# Altium project 003.ccd424.PrjPcb
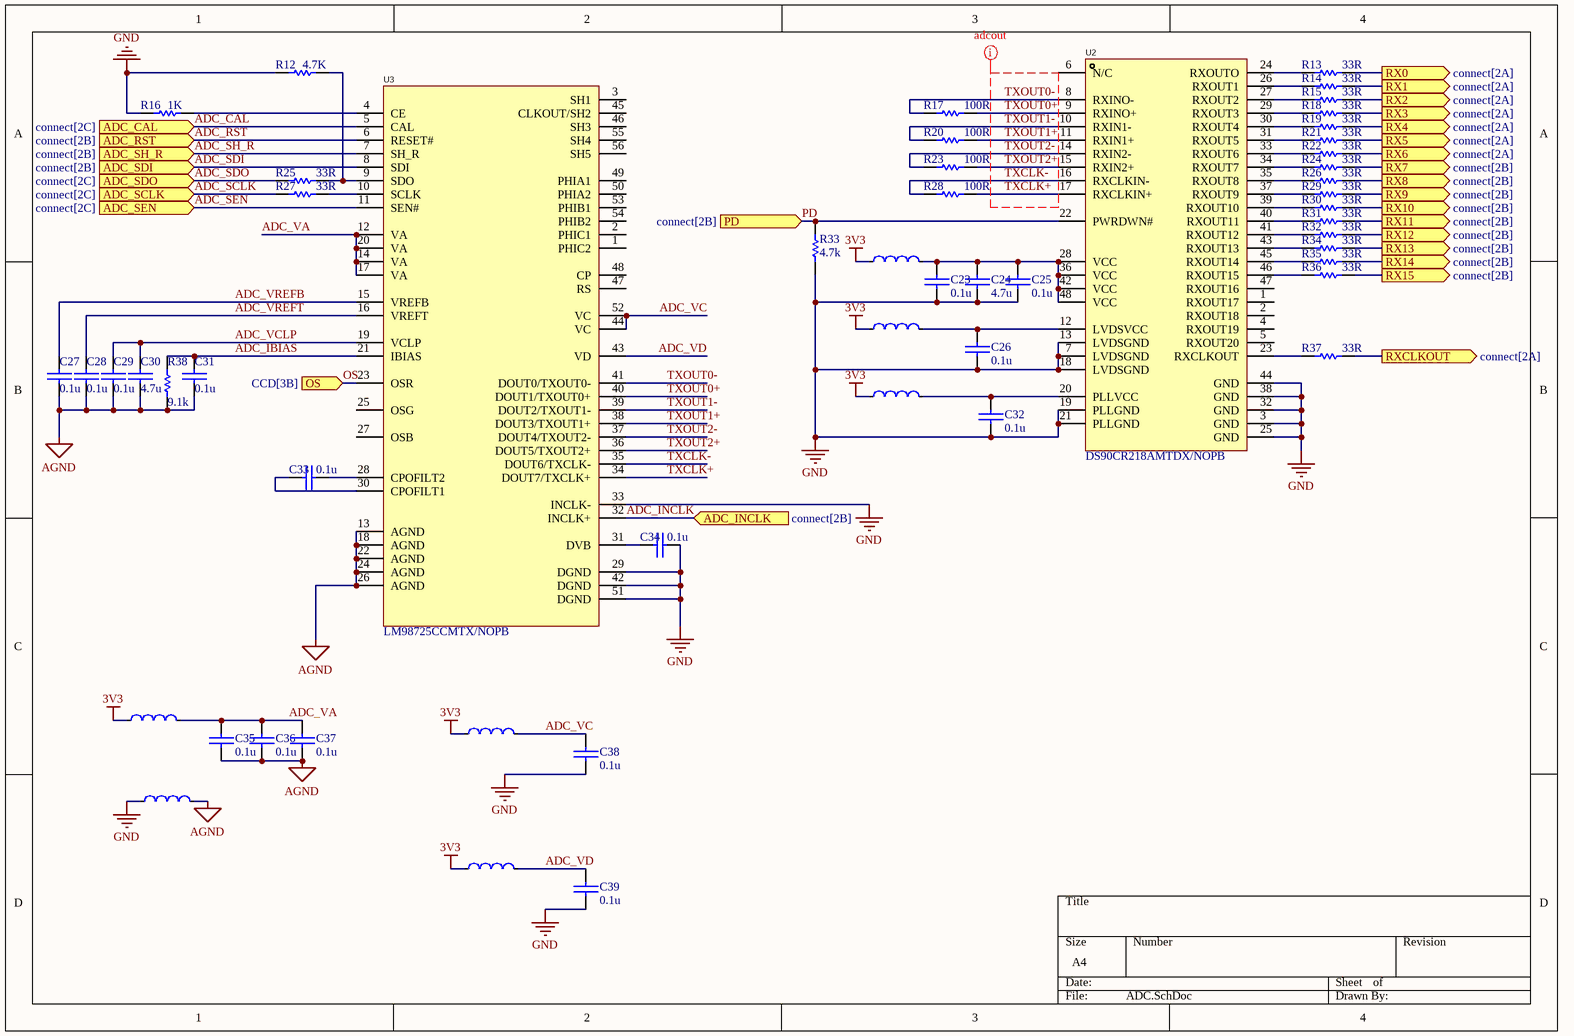
[diagram p0: ADC.SchDoc]
2 sheets, 82 parts. Net scope: flat (ports and power ports of the same name join across sheets).
Board file: PCB2.PcbDoc
Sheets:
  ADC.SchDoc
  timing.SchDoc

## Sheet ADC.SchDoc
size A4; SheetNumber: 3; SheetTotal: 5

### Parts
C23  0.1u  [0603C]
C24  4.7u  [0603C]
C25  0.1u  [0603C]
C26  0.1u  [0603C]
C27  0.1u  [0603C]
C28  0.1u  [0603C]
C29  0.1u  [0603C]
C30  4.7u  [0603C]
C31  0.1u  [0603C]
C32  0.1u  [0603C]
C33  0.1u  [0603C]
C34  0.1u  [0603C]
C35  0.1u  [0603C]
C36  0.1u  [0603C]
C37  0.1u  [0603C]
C38  0.1u  [0603C]
C39  0.1u  [0603C]
L4  GZ1608D601TF  [0603L]  (value not drawn)
L5  GZ1608D601TF  [0603L]  (value not drawn)
L6  GZ1608D601TF  [0603L]  (value not drawn)
L7  GZ1608D601TF  [0603L]  (value not drawn)
L8  GZ1608D601TF  [0603L]  (value not drawn)
L9  GZ1608D601TF  [0603L]  (value not drawn)
L10  GZ1608D601TF  [0603L]  (value not drawn)
R12  4.7K  [0603R]
R13  33R  [0603R]
R14  33R  [0603R]
R15  33R  [0603R]
R16  1K  [0603R]
R17  100R  [0603R]
R18  33R  [0603R]
R19  33R  [0603R]
R20  100R  [0603R]
R21  33R  [0603R]
R22  33R  [0603R]
R23  100R  [0603R]
R24  33R  [0603R]
R25  33R  [0603R]
R26  33R  [0603R]
R27  33R  [0603R]
R28  100R  [0603R]
R29  33R  [0603R]
R30  33R  [0603R]
R31  33R  [0603R]
R32  33R  [0603R]
R33  4.7k  [0603R]
R34  33R  [0603R]
R35  33R  [0603R]
R36  33R  [0603R]
R37  33R  [0603R]
R38  9.1k  [0603R]
U2  DS90CR218AMTDX/NOPB  [TSSOP-48]
U3  LM98725CCMTX/NOPB  [TSSOP-56]

### Ports
ADC_CAL (in, see connect[2C]), ADC_INCLK (in, see connect[2B]), ADC_RST (in, see connect[2B]), ADC_SCLK (in, see connect[2C]), ADC_SDI (in, see connect[2B]), ADC_SDO (in, see connect[2C]), ADC_SEN (in, see connect[2C]), ADC_SH_R (in, see connect[2B]), OS (in, see CCD[3B]), PD (in, see connect[2B]), RX0 (out, see connect[2A]), RX1 (out, see connect[2A]), RX2 (out, see connect[2A]), RX3 (out, see connect[2A]), RX4 (out, see connect[2A]), RX5 (out, see connect[2A]), RX6 (out, see connect[2A]), RX7 (out, see connect[2B]), RX8 (out, see connect[2B]), RX9 (out, see connect[2B]), RX10 (out, see connect[2B]), RX11 (out, see connect[2B]), RX12 (out, see connect[2B]), RX13 (out, see connect[2B]), RX14 (out, see connect[2B]), RX15 (out, see connect[2B]), RXCLKOUT (out, see connect[2A])

### Nets
3V3: L4.1 L5.1 L6.1 L7.1 L8.1 L10.1
AGND: C27.2 C28.2 C29.2 C30.2 C31.2 C35.1 C36.1 C37.1 L9.2 R38.1 U3.13(AGND) U3.18(AGND) U3.22(AGND) U3.24(AGND) U3.26(AGND)
GND: C23.1 C24.1 C25.1 C26.1 C32.1 C34.2 C38.1 C39.1 L9.1 R12.1 R16.1 R33.1 U2.3(GND) U2.7(LVDSGND) U2.13(LVDSGND) U2.18(LVDSGND) U2.19(PLLGND) U2.21(PLLGND) U2.25(GND) U2.32(GND) U2.38(GND) U2.44(GND) U3.29(DGND) U3.33(INCLK-) U3.42(DGND) U3.51(DGND)
ADC_CAL: U3.5(CAL) ; port ADC_CAL
ADC_IBIAS: C31.1 R38.2 U3.21(IBIAS)
ADC_INCLK: U3.32(INCLK+) ; port ADC_INCLK
ADC_RST: U3.6(RESET#) ; port ADC_RST
ADC_SCLK: R27.1 ; port ADC_SCLK
ADC_SDI: U3.8(SDI) ; port ADC_SDI
ADC_SDO: R25.1 ; port ADC_SDO
ADC_SEN: U3.11(SEN#) ; port ADC_SEN
ADC_SH_R: U3.7(SH_R) ; port ADC_SH_R
ADC_VA: C35.2 C36.2 C37.2 L7.2 U3.12(VA) U3.14(VA) U3.17(VA) U3.20(VA)
ADC_VC: C38.2 L8.2 U3.44(VC) U3.52(VC)
ADC_VCLP: C29.1 C30.1 U3.19(VCLP)
ADC_VD: C39.2 L10.2 U3.43(VD)
ADC_VREFB: C27.1 U3.15(VREFB)
ADC_VREFT: C28.1 U3.16(VREFT)
OS: U3.23(OSR) ; port OS
PD: R33.2 U2.22(PWRDWN#) ; port PD
TXCLK+: R28.2 U2.17(RXCLKIN+) U3.34(DOUT7/TXCLK+)
TXCLK-: R28.1 U2.16(RXCLKIN-) U3.35(DOUT6/TXCLK-)
TXOUT0+: R17.2 U2.9(RXINO+) U3.40(DOUT1/TXOUT0+)
TXOUT0-: R17.1 U2.8(RXINO-) U3.41(DOUT0/TXOUT0-)
TXOUT1+: R20.2 U2.11(RXIN1+) U3.38(DOUT3/TXOUT1+)
TXOUT1-: R20.1 U2.10(RXIN1-) U3.39(DOUT2/TXOUT1-)
TXOUT2+: R23.2 U2.15(RXIN2+) U3.36(DOUT5/TXOUT2+)
TXOUT2-: R23.1 U2.14(RXIN2-) U3.37(DOUT4/TXOUT2-)
NetC23_2: C23.2 C24.2 C25.2 L4.2 U2.28(VCC) U2.36(VCC) U2.42(VCC) U2.48(VCC)
NetC26_2: C26.2 L5.2 U2.12(LVDSVCC)
NetC32_2: C32.2 L6.2 U2.20(PLLVCC)
NetC33_1: C33.1 U3.30(CPOFILT1)
NetC33_2: C33.2 U3.28(CPOFILT2)
NetC34_1: C34.1 U3.31(DVB)
NetR12_2: R12.2 R25.2 U3.9(SDO)
NetR13_1: R13.1 U2.24(RXOUTO)
NetR13_2: R13.2 ; port RX0
NetR14_1: R14.1 U2.26(RXOUT1)
NetR14_2: R14.2 ; port RX1
NetR15_1: R15.1 U2.27(RXOUT2)
NetR15_2: R15.2 ; port RX2
NetR16_2: R16.2 U3.4(CE)
NetR18_1: R18.1 U2.29(RXOUT3)
NetR18_2: R18.2 ; port RX3
NetR19_1: R19.1 U2.30(RXOUT4)
NetR19_2: R19.2 ; port RX4
NetR21_1: R21.1 U2.31(RXOUT5)
NetR21_2: R21.2 ; port RX5
NetR22_1: R22.1 U2.33(RXOUT6)
NetR22_2: R22.2 ; port RX6
NetR24_1: R24.1 U2.34(RXOUT7)
NetR24_2: R24.2 ; port RX7
NetR26_1: R26.1 U2.35(RXOUT8)
NetR26_2: R26.2 ; port RX8
NetR27_2: R27.2 U3.10(SCLK)
NetR29_1: R29.1 U2.37(RXOUT9)
NetR29_2: R29.2 ; port RX9
NetR30_1: R30.1 U2.39(RXOUT10)
NetR30_2: R30.2 ; port RX10
NetR31_1: R31.1 U2.40(RXOUT11)
NetR31_2: R31.2 ; port RX11
NetR32_1: R32.1 U2.41(RXOUT12)
NetR32_2: R32.2 ; port RX12
NetR34_1: R34.1 U2.43(RXOUT13)
NetR34_2: R34.2 ; port RX13
NetR35_1: R35.1 U2.45(RXOUT14)
NetR35_2: R35.2 ; port RX14
NetR36_1: R36.1 U2.46(RXOUT15)
NetR36_2: R36.2 ; port RX15
NetR37_1: R37.1 U2.23(RXCLKOUT)
NetR37_2: R37.2 ; port RXCLKOUT

Not connected (* = marked no-connect by the designer): U2 1(RXOUT17) 2(RXOUT18) 4(RXOUT19) 5(RXOUT20) 6(N/C) 47(RXOUT16); U3 1(PHIC2) 2(PHIC1) 3(SH1) 25(OSG) 27(OSB) 45(CLKOUT/SH2) 46(SH3) 47(RS) 48(CP) 49(PHIA1) 50(PHIA2) 53(PHIB1) 54(PHIB2) 55(SH4) 56(SH5)

### Layout directives
mark named adcout: TXCLK+, TXCLK-, TXOUT0+, TXOUT0-, TXOUT1+, TXOUT1-, TXOUT2+, TXOUT2-

### Library data of the parts
C23-C39 = CAP: 无极性电容
L4-L10 = FB: 铁氧体磁珠; Manufacturer: Sunlord(顺络); Add into BOM: yes; Impedance @ Frequency: 600Ω@100MHz; Tolerance: ±25%; DC Resistance: 450mΩ; Current Rating: 200mA; Circuits: 1; Name: GZ1608D601TF; Symbol: GZ1608D601TF; Device: GZ1608D601TF; LCSC Part Name: 600Ω@100MHz ±25%; Supplier Part: C1002; Manufacturer Part: GZ1608D601TF; Supplier Footprint: 0603; JLCPCB Part Class: Basic Part; Datasheet: https://atta.szlcsc.com/upload/public/pdf/source/20210830/355EA7C0FAC5394FC0FE3F17C770C20A.pdf; Supplier: LCSC; Convert to PCB: yes
R12-R38 = RES: 电阻
U2 = DS90CR218AMTDX/NOPB: 解串芯片; Manufacturer: TI(德州仪器); Add into BOM: yes; Name: DS90CR218AMTDX/NOPB; Symbol: DS90CR218AMTDX/NOPB; Device: DS90CR218AMTDX/NOPB; LCSC Part Name: DS90CR218AMTDX/NOPB; Supplier Part: C2674207; Manufacturer Part: DS90CR218AMTDX/NOPB; Supplier Footprint: TSSOP-48; JLCPCB Part Class: Extended Part; Supplier: LCSC; Convert to PCB: yes
U3 = LM98725CCMTX/NOPB: CCD专用ADC; Manufacturer: TI(德州仪器); Add into BOM: yes; Name: LM98725CCMTX/NOPB; Symbol: LM98725CCMTX/NOPB; Device: LM98725CCMTX/NOPB; LCSC Part Name: LM98725CCMTX/NOPB; Supplier Part: C2679405; Manufacturer Part: LM98725CCMTX/NOPB; Supplier Footprint: TSSOP-56; JLCPCB Part Class: Extended Part; Supplier: LCSC; Convert to PCB: yes

## Sheet timing.SchDoc
size A4; SheetNumber: 5; SheetTotal: 5
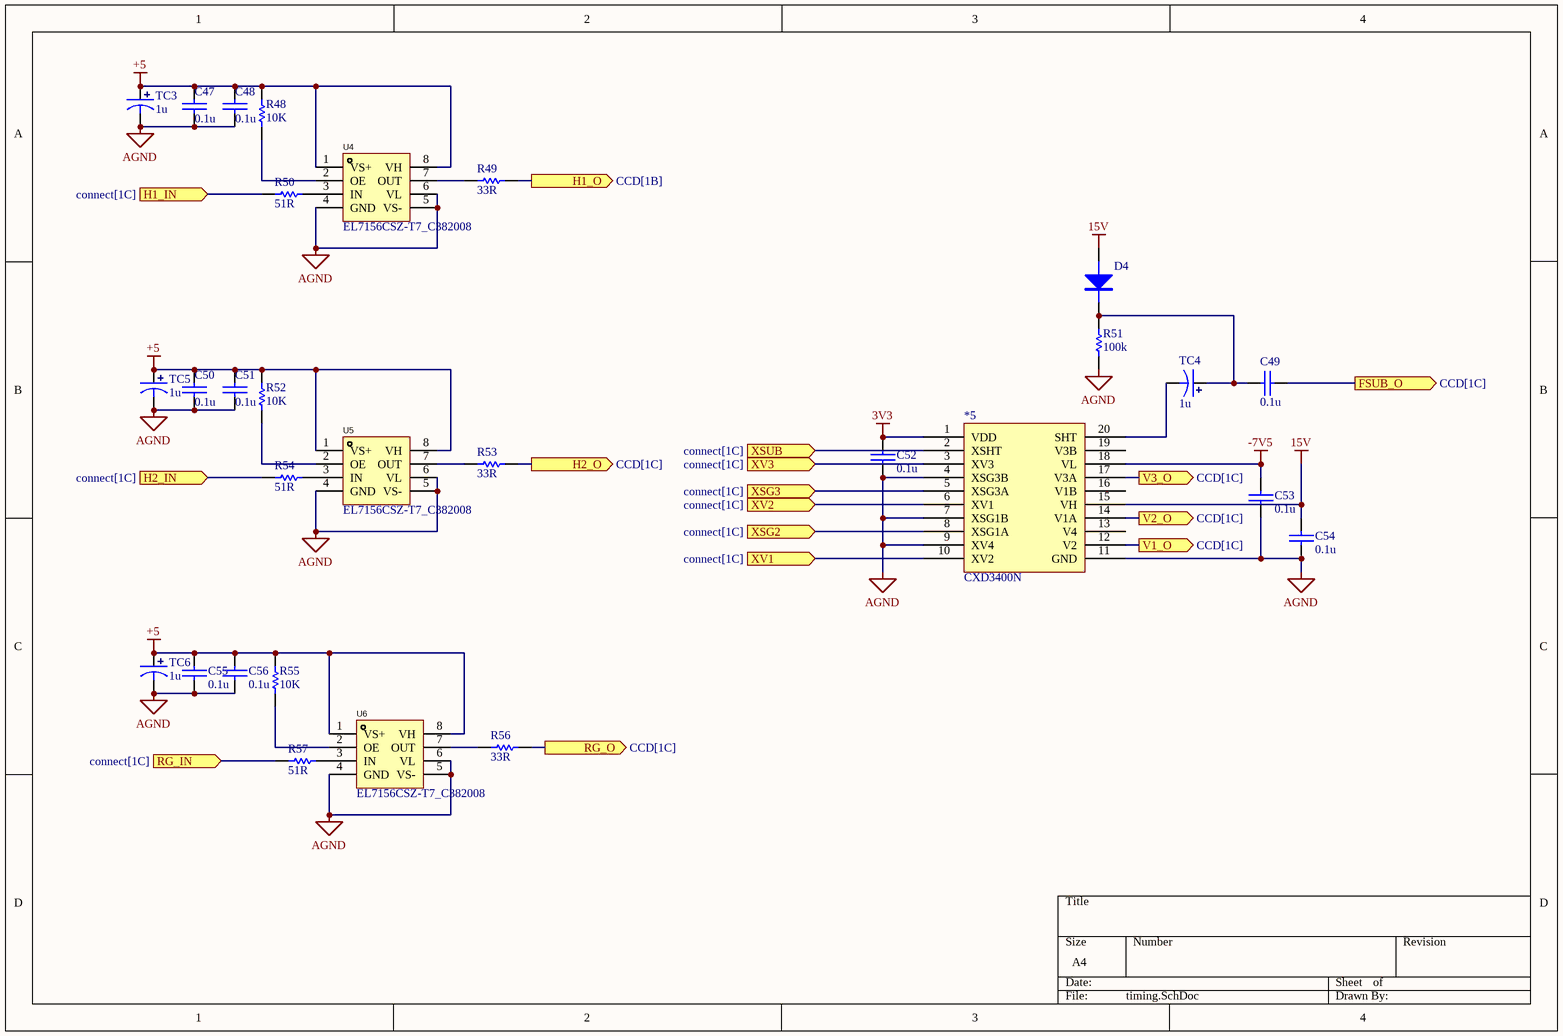
[diagram p1: timing.SchDoc]

### Parts
*5  CXD3400N  [CXD3400N]
C47  0.1u  [0603C]
C48  0.1u  [0603C]
C49  0.1u  [0603C]
C50  0.1u  [0603C]
C51  0.1u  [0603C]
C52  0.1u  [0603C]
C53  0.1u  [0603C]
C54  0.1u  [0603C]
C55  0.1u  [0603C]
C56  0.1u  [0603C]
D4  DIODE  [SOD-123]  (value not drawn)
R48  10K  [0603R]
R49  33R  [0603R]
R50  51R  [0603R]
R51  100k  [0603R]
R52  10K  [0603R]
R53  33R  [0603R]
R54  51R  [0603R]
R55  10K  [0603R]
R56  33R  [0603R]
R57  51R  [0603R]
TC3  1u  [TAJ-A/3216]
TC4  1u  [TAJ-A/3216]
TC5  1u  [TAJ-A/3216]
TC6  1u  [TAJ-A/3216]
U4  EL7156CSZ-T7_C382008  [SOIC-8]
U5  EL7156CSZ-T7_C382008  [SOIC-8]
U6  EL7156CSZ-T7_C382008  [SOIC-8]

### Ports
FSUB_O (out, see CCD[1C]), H1_IN (in, see connect[1C]), H1_O (out, see CCD[1B]), H2_IN (in, see connect[1C]), H2_O (out, see CCD[1C]), RG_IN (in, see connect[1C]), RG_O (out, see CCD[1C]), V1_O (out, see CCD[1C]), V2_O (out, see CCD[1C]), V3_O (out, see CCD[1C]), XSG2 (in, see connect[1C]), XSG3 (in, see connect[1C]), XSUB (in, see connect[1C]), XV1 (in, see connect[1C]), XV2 (in, see connect[1C]), XV3 (in, see connect[1C])

### Nets
3V3: *5.1(VDD) C52.2
15V: *5.15(VH) C54.2 D4.A
+5: C47.1 C48.1 C50.1 C51.1 C55.1 C56.1 R48.1 R52.1 R55.1 TC3.1 TC5.1 TC6.1 U4.1(VS+) U4.8(VH) U5.1(VS+) U5.8(VH) U6.1(VS+) U6.8(VH)
-7V5: *5.18(VL) C53.2
AGND: *5.4(XSG3B) *5.7(XSG1B) *5.9(XV4) *5.11(GND) C47.2 C48.2 C50.2 C51.2 C52.1 C53.1 C54.1 C55.2 C56.2 R51.1 TC3.2 TC5.2 TC6.2 U4.4(GND) U4.5(VS-) U4.6(VL) U5.4(GND) U5.5(VS-) U5.6(VL) U6.4(GND) U6.5(VS-) U6.6(VL)
Net*5_2: *5.2(XSHT) ; port XSUB
Net*5_3: *5.3(XV3) ; port XV3
Net*5_5: *5.5(XSG3A) ; port XSG3
Net*5_6: *5.6(XV1) ; port XV2
Net*5_8: *5.8(XSG1A) ; port XSG2
Net*5_10: *5.10(XV2) ; port XV1
Net*5_12: *5.12(V2) ; port V1_O
Net*5_14: *5.14(V1A) ; port V2_O
Net*5_17: *5.17(V3A) ; port V3_O
Net*5_20: *5.20(SHT) TC4.2
NetC49_1: C49.1 ; port FSUB_O
NetC49_2: C49.2 D4.K R51.2 TC4.1
NetR48_2: R48.2 U4.2(OE)
NetR49_1: R49.1 ; port H1_O
NetR49_2: R49.2 U4.7(OUT)
NetR50_1: R50.1 U4.3(IN)
NetR50_2: R50.2 ; port H1_IN
NetR52_2: R52.2 U5.2(OE)
NetR53_1: R53.1 ; port H2_O
NetR53_2: R53.2 U5.7(OUT)
NetR54_1: R54.1 U5.3(IN)
NetR54_2: R54.2 ; port H2_IN
NetR55_2: R55.2 U6.2(OE)
NetR56_1: R56.1 ; port RG_O
NetR56_2: R56.2 U6.7(OUT)
NetR57_1: R57.1 U6.3(IN)
NetR57_2: R57.2 ; port RG_IN

Not connected (* = marked no-connect by the designer): *5 13(V4) 16(V1B) 19(V3B)

### Library data of the parts
*5 = CXD3400N: 6通道垂直时钟驱动器
C47-C56 = CAP: 无极性电容
D4 = DIODE: 普通二极管
R48-R57 = RES: 电阻
TC3-TC6 = TCAP: 钽电容
U4-U6 = EL7156CSZ-T7: 栅极驱动器; Manufacturer: Intersil(英特矽尔); Add into BOM: yes; Name: EL7156CSZ-T7; Symbol: EL7156CSZ-T7; Device: EL7156CSZ-T7_C382008; LCSC Part Name: EL7156CSZ-T7; Supplier Part: C382008; Manufacturer Part: EL7156CSZ-T7; Supplier Footprint: SOIC-8; JLCPCB Part Class: Extended Part; Datasheet: https://atta.szlcsc.com/upload/public/pdf/source/20190409/C382008_2839965C4C72C039364B6D8C7260FFBC.pdf; Supplier: LCSC; Convert to PCB: yes

## Nets that join several sheets
3V3: ADC (6 pins), timing (*5.1 C52.2)
AGND: ADC (15 pins), timing (26 pins)